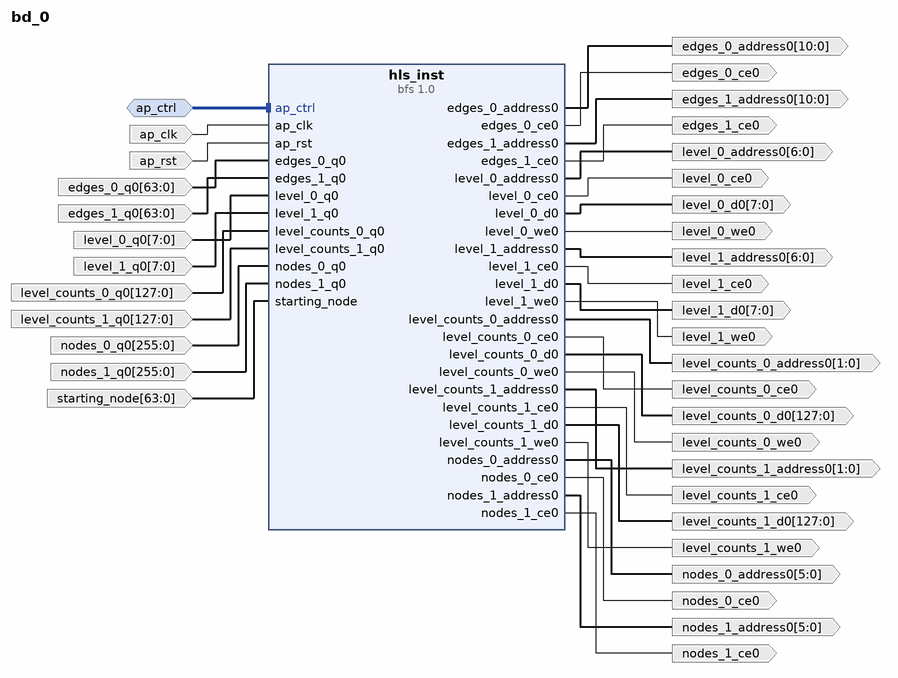
[diagram p0: block diagram of the top level]
# Vivado block design bd_0, xc7vx485tffg1761-2, Vivado 2022.2.2
create_bd_design bd_0

create_bd_intf_port -mode Slave -vlnv xilinx.com:interface:acc_handshake_rtl:1.0 ap_ctrl
create_bd_port -dir I -type clk ap_clk
set_property -dict {CONFIG.FREQ_HZ 100000000.0} [get_bd_ports ap_clk]
create_bd_port -dir I -type rst ap_rst
set_property -dict {CONFIG.POLARITY ACTIVE_HIGH} [get_bd_ports ap_rst]
create_bd_port -dir O -from 10 -to 0 -type data edges_0_address0
create_bd_port -dir O edges_0_ce0
create_bd_port -dir I -from 63 -to 0 -type data edges_0_q0
create_bd_port -dir O -from 10 -to 0 -type data edges_1_address0
create_bd_port -dir O edges_1_ce0
create_bd_port -dir I -from 63 -to 0 -type data edges_1_q0
create_bd_port -dir O -from 6 -to 0 -type data level_0_address0
create_bd_port -dir O level_0_ce0
create_bd_port -dir O -from 7 -to 0 -type data level_0_d0
create_bd_port -dir I -from 7 -to 0 -type data level_0_q0
create_bd_port -dir O level_0_we0
create_bd_port -dir O -from 6 -to 0 -type data level_1_address0
create_bd_port -dir O level_1_ce0
create_bd_port -dir O -from 7 -to 0 -type data level_1_d0
create_bd_port -dir I -from 7 -to 0 -type data level_1_q0
create_bd_port -dir O level_1_we0
create_bd_port -dir O -from 1 -to 0 -type data level_counts_0_address0
create_bd_port -dir O level_counts_0_ce0
create_bd_port -dir O -from 127 -to 0 -type data level_counts_0_d0
create_bd_port -dir I -from 127 -to 0 -type data level_counts_0_q0
create_bd_port -dir O level_counts_0_we0
create_bd_port -dir O -from 1 -to 0 -type data level_counts_1_address0
create_bd_port -dir O level_counts_1_ce0
create_bd_port -dir O -from 127 -to 0 -type data level_counts_1_d0
create_bd_port -dir I -from 127 -to 0 -type data level_counts_1_q0
create_bd_port -dir O level_counts_1_we0
create_bd_port -dir O -from 5 -to 0 -type data nodes_0_address0
create_bd_port -dir O nodes_0_ce0
create_bd_port -dir I -from 255 -to 0 -type data nodes_0_q0
create_bd_port -dir O -from 5 -to 0 -type data nodes_1_address0
create_bd_port -dir O nodes_1_ce0
create_bd_port -dir I -from 255 -to 0 -type data nodes_1_q0
create_bd_port -dir I -from 63 -to 0 -type data starting_node

create_bd_cell -type ip -vlnv xilinx.com:hls:bfs:1.0 hls_inst

# ---- connections ----

connect_bd_intf_net -intf_net ap_ctrl_0_1 [get_bd_intf_ports ap_ctrl] [get_bd_intf_pins hls_inst/ap_ctrl]
connect_bd_net -net ap_clk_0_1 [get_bd_ports ap_clk] [get_bd_pins hls_inst/ap_clk]
connect_bd_net -net ap_rst_0_1 [get_bd_ports ap_rst] [get_bd_pins hls_inst/ap_rst]
connect_bd_net -net edges_0_q0_0_1 [get_bd_ports edges_0_q0] [get_bd_pins hls_inst/edges_0_q0]
connect_bd_net -net edges_1_q0_0_1 [get_bd_ports edges_1_q0] [get_bd_pins hls_inst/edges_1_q0]
connect_bd_net [get_bd_pins hls_inst/edges_0_address0] [get_bd_ports edges_0_address0]
connect_bd_net [get_bd_pins hls_inst/edges_0_ce0] [get_bd_ports edges_0_ce0]
connect_bd_net [get_bd_pins hls_inst/edges_1_address0] [get_bd_ports edges_1_address0]
connect_bd_net [get_bd_pins hls_inst/edges_1_ce0] [get_bd_ports edges_1_ce0]
connect_bd_net [get_bd_pins hls_inst/level_0_address0] [get_bd_ports level_0_address0]
connect_bd_net [get_bd_pins hls_inst/level_0_ce0] [get_bd_ports level_0_ce0]
connect_bd_net [get_bd_pins hls_inst/level_0_d0] [get_bd_ports level_0_d0]
connect_bd_net [get_bd_pins hls_inst/level_0_we0] [get_bd_ports level_0_we0]
connect_bd_net [get_bd_pins hls_inst/level_1_address0] [get_bd_ports level_1_address0]
connect_bd_net [get_bd_pins hls_inst/level_1_ce0] [get_bd_ports level_1_ce0]
connect_bd_net [get_bd_pins hls_inst/level_1_d0] [get_bd_ports level_1_d0]
connect_bd_net [get_bd_pins hls_inst/level_1_we0] [get_bd_ports level_1_we0]
connect_bd_net [get_bd_pins hls_inst/level_counts_0_address0] [get_bd_ports level_counts_0_address0]
connect_bd_net [get_bd_pins hls_inst/level_counts_0_ce0] [get_bd_ports level_counts_0_ce0]
connect_bd_net [get_bd_pins hls_inst/level_counts_0_d0] [get_bd_ports level_counts_0_d0]
connect_bd_net [get_bd_pins hls_inst/level_counts_0_we0] [get_bd_ports level_counts_0_we0]
connect_bd_net [get_bd_pins hls_inst/level_counts_1_address0] [get_bd_ports level_counts_1_address0]
connect_bd_net [get_bd_pins hls_inst/level_counts_1_ce0] [get_bd_ports level_counts_1_ce0]
connect_bd_net [get_bd_pins hls_inst/level_counts_1_d0] [get_bd_ports level_counts_1_d0]
connect_bd_net [get_bd_pins hls_inst/level_counts_1_we0] [get_bd_ports level_counts_1_we0]
connect_bd_net [get_bd_pins hls_inst/nodes_0_address0] [get_bd_ports nodes_0_address0]
connect_bd_net [get_bd_pins hls_inst/nodes_0_ce0] [get_bd_ports nodes_0_ce0]
connect_bd_net [get_bd_pins hls_inst/nodes_1_address0] [get_bd_ports nodes_1_address0]
connect_bd_net [get_bd_pins hls_inst/nodes_1_ce0] [get_bd_ports nodes_1_ce0]
connect_bd_net -net level_0_q0_0_1 [get_bd_ports level_0_q0] [get_bd_pins hls_inst/level_0_q0]
connect_bd_net -net level_1_q0_0_1 [get_bd_ports level_1_q0] [get_bd_pins hls_inst/level_1_q0]
connect_bd_net -net level_counts_0_q0_0_1 [get_bd_ports level_counts_0_q0] [get_bd_pins hls_inst/level_counts_0_q0]
connect_bd_net -net level_counts_1_q0_0_1 [get_bd_ports level_counts_1_q0] [get_bd_pins hls_inst/level_counts_1_q0]
connect_bd_net -net nodes_0_q0_0_1 [get_bd_ports nodes_0_q0] [get_bd_pins hls_inst/nodes_0_q0]
connect_bd_net -net nodes_1_q0_0_1 [get_bd_ports nodes_1_q0] [get_bd_pins hls_inst/nodes_1_q0]
connect_bd_net -net starting_node_0_1 [get_bd_ports starting_node] [get_bd_pins hls_inst/starting_node]

validate_bd_design
save_bd_design
